# Altium schematic sheet jetson-nano.SchDoc
size A3
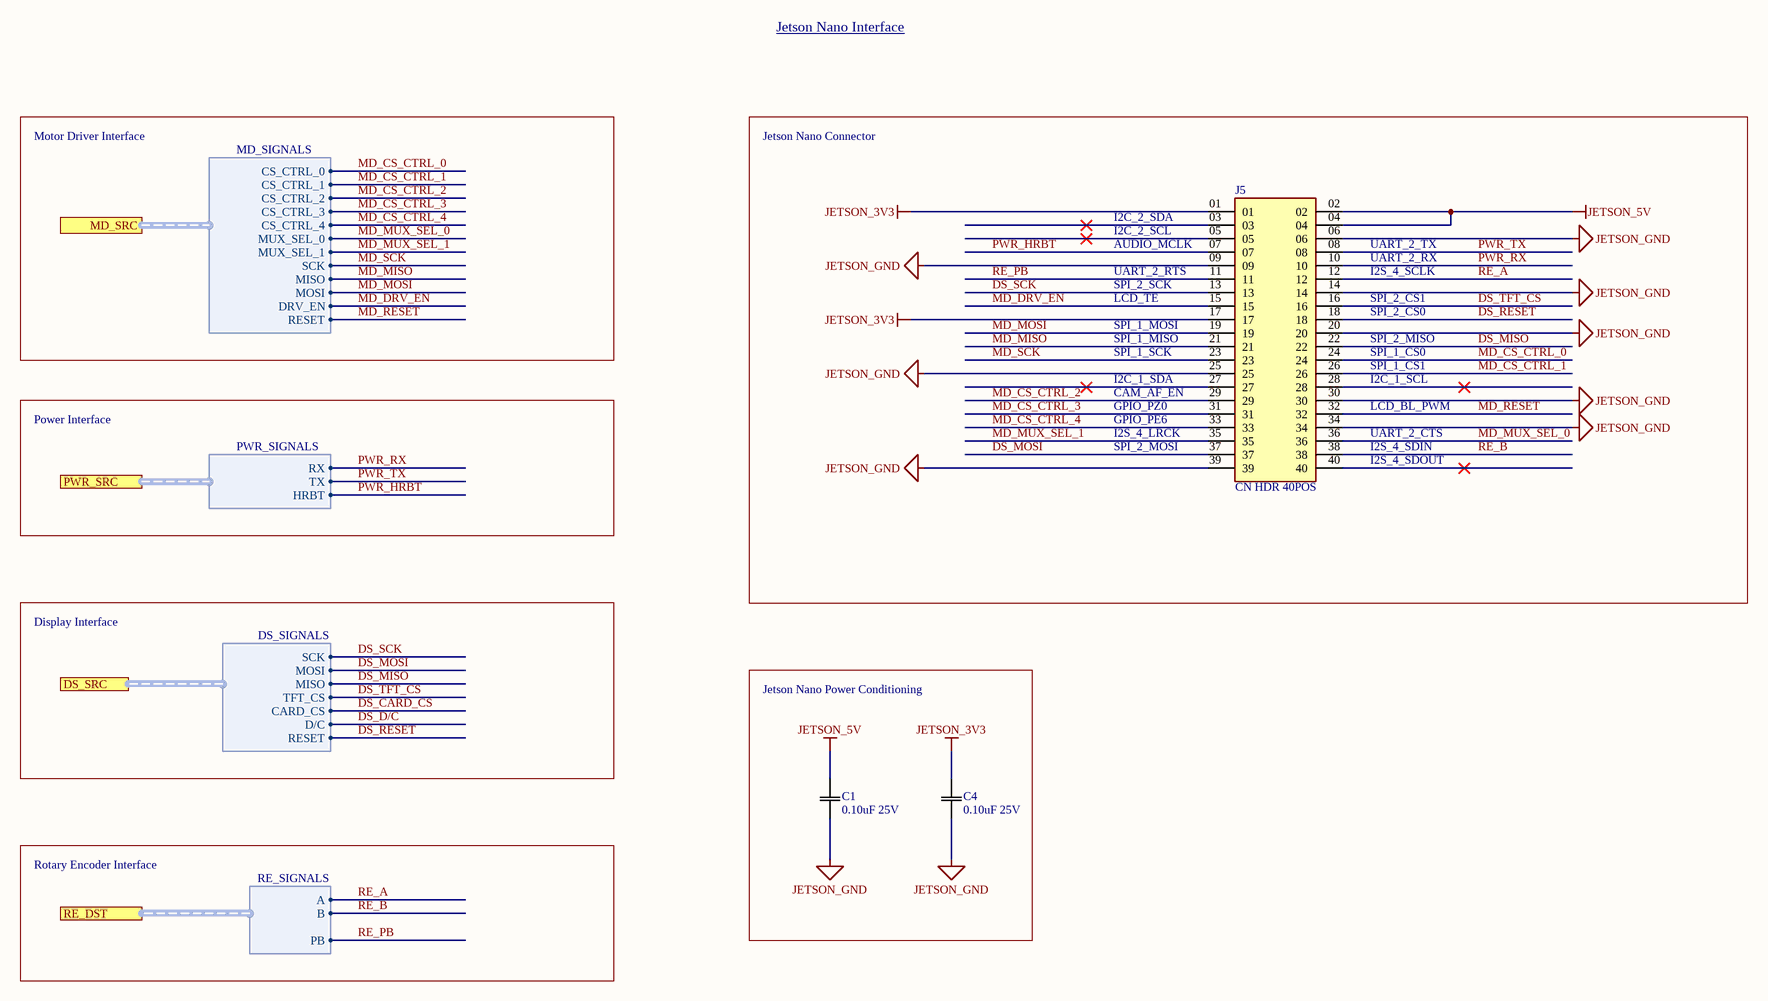
[diagram p0: jetson-nano.SchDoc]

## Parts
C1  0.10uF 25V  [0805]
C4  0.10uF 25V  [0805]
J5  CN HDR 40POS  [CN HDR 40POS 0.1 TH]

## Blocks framed on the sheet
Jetson Nano Power Conditioning: C1 C4

## Ports
DS_SRC (harness DS_SIGNALS), MD_SRC (harness MD_SIGNALS), PWR_SRC (harness PWR_SIGNALS), RE_DST (harness RE_SIGNALS)

## Harnesses
DS_SIGNALS: SCK, MOSI, MISO, TFT_CS, CARD_CS, D/C, RESET
PWR_SIGNALS: TX, RX, HRBT
MD_SIGNALS: CS_CTRL_0, MUX_SEL_1, SCK, MOSI, MISO, CS_CTRL_1, CS_CTRL_2, CS_CTRL_3, CS_CTRL_4, MUX_SEL_0, DRV_EN, RESET
RE_SIGNALS: A, B, PB

## Nets
JETSON_3V3: C4.2(C2) J5.01 J5.17
JETSON_5V: C1.2(C2) J5.02 J5.04
JETSON_GND: C1.1(C1) C4.1(C1) J5.06 J5.09 J5.14 J5.20 J5.25 J5.30 J5.34 J5.39
DS_CARD_CS: port DS_SRC.CARD_CS
DS_D/C: port DS_SRC.D/C
DS_MISO: J5.22 ; port DS_SRC.MISO
DS_MOSI: J5.37 ; port DS_SRC.MOSI
DS_RESET: J5.18 ; port DS_SRC.RESET
DS_SCK: J5.13 ; port DS_SRC.SCK
DS_TFT_CS: J5.16 ; port DS_SRC.TFT_CS
MD_CS_CTRL_0: J5.24 ; port MD_SRC.CS_CTRL_0
MD_CS_CTRL_1: J5.26 ; port MD_SRC.CS_CTRL_1
MD_CS_CTRL_2: J5.29 ; port MD_SRC.CS_CTRL_2
MD_CS_CTRL_3: J5.31 ; port MD_SRC.CS_CTRL_3
MD_CS_CTRL_4: J5.33 ; port MD_SRC.CS_CTRL_4
MD_DRV_EN: J5.15 ; port MD_SRC.DRV_EN
MD_MISO: J5.21 ; port MD_SRC.MISO
MD_MOSI: J5.19 ; port MD_SRC.MOSI
MD_MUX_SEL_0: J5.36 ; port MD_SRC.MUX_SEL_0
MD_MUX_SEL_1: J5.35 ; port MD_SRC.MUX_SEL_1
MD_RESET: J5.32 ; port MD_SRC.RESET
MD_SCK: J5.23 ; port MD_SRC.SCK
PWR_HRBT: J5.07 ; port PWR_SRC.HRBT
PWR_RX: J5.10 ; port PWR_SRC.RX
PWR_TX: J5.08 ; port PWR_SRC.TX
RE_A: J5.12 ; port RE_DST.A
RE_B: J5.38 ; port RE_DST.B
RE_PB: J5.11 ; port RE_DST.PB

Not connected (* = marked no-connect by the designer): J5 03* 05* 27* 28* 40*

## Notes on the sheet
- Jetson Nano Interface
- Motor Driver Interface
- Jetson Nano Connector
- AUDIO_MCLK
- UART_2_RTS
- I2C_2_SDA
- I2C_2_SCL
- I2S_4_SCLK
- UART_2_TX
- UART_2_RX
- LCD_TE
- SPI_2_SCK
- SPI_1_MOSI
- SPI_1_MISO
- SPI_2_CS1
- SPI_2_MISO
- SPI_2_CS0
- GPIO_PZ0
- CAM_AF_EN
- SPI_1_SCK
- I2C_1_SDA
- LCD_BL_PWM
- SPI_1_CS0
- SPI_1_CS1
- I2C_1_SCL
- Power Interface
- SPI_2_MOSI
- I2S_4_LRCK
- GPIO_PE6
- I2S_4_SDIN
- UART_2_CTS
- I2S_4_SDOUT
- Display Interface
- Rotary Encoder Interface

## Library data of the parts
C1 C4 = CAP 0.10uF 25V: CAP CER 0.10UF 25V X7R 0805; Value: 0.1uF; Tolerance: 10%; Temperature Coefficient: X7R; Rating: 25V; Part Number: CAP 0.10uF 25V; Operating Temperature: -55°C ~ 125°C
J5 = CN HDR 40POS: 40 Position Header Connector; Part Number: CN HDR 40POS; Supplier 1: Digi-Key; Supplier Part Number 1: S6104-ND; Supplier URL 1: https://www.digikey.ca/en/products/detail/sullins-connector-solutions/PPTC202LFBN-RC/807240?s=N4IgTCBcDaIMoDYCMAGALAWgHIBEQF0BfIA; Pin Count: 40